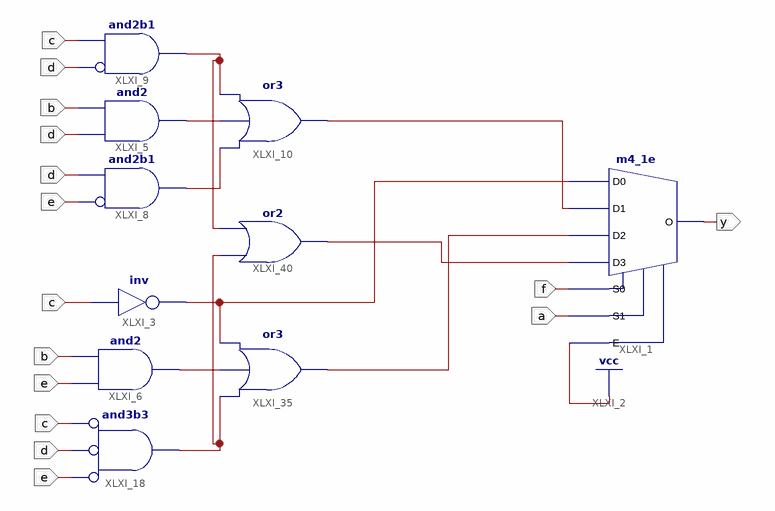
[diagram p0: schematic sheet 1]
// Xilinx ISE schematic MUX4.sch (spartan6) as structural Verilog: 10 symbols, 7 ports
module MUX4 (
  input  f,
  input  a,
  input  c,
  input  d,
  input  b,
  input  e,
  output y
);

  wire XLXN_21, XLXN_22, XLXN_23, XLXN_24, XLXN_86, XLXN_87, XLXN_88, XLXN_108, XLXN_110;

  m4_1e XLXI_1 (.D0(XLXN_87), .D1(XLXN_24), .D2(XLXN_108), .D3(XLXN_110), .E(1'b1), .S0(f), .S1(a), .O(y));
  and XLXI_9 (XLXN_21, ~d, c);  // and2b1
  and XLXI_5 (XLXN_22, d, b);
  and XLXI_8 (XLXN_23, ~e, d);  // and2b1
  or XLXI_10 (XLXN_24, XLXN_23, XLXN_22, XLXN_21);
  or XLXI_35 (XLXN_108, XLXN_88, XLXN_86, XLXN_87);
  not XLXI_3 (XLXN_87, c);
  and XLXI_18 (XLXN_88, ~e, ~d, ~c);  // and3b3
  and XLXI_6 (XLXN_86, e, b);
  or XLXI_40 (XLXN_110, XLXN_88, XLXN_21);
endmodule
